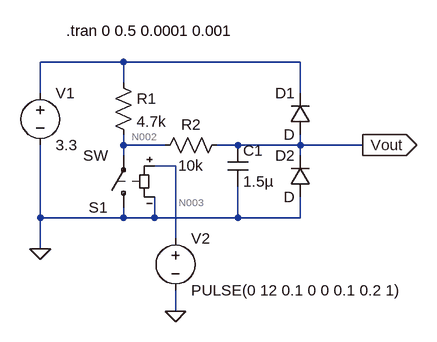
[diagram p0: schematic PB_RC_DEBOUNCE_SIM_R20200727A.asc]
PB_RC_DEBOUNCE_SIM_R20200727A.asc, the LTspice schematic file:
Version 4
SHEET 1 964 680
WIRE 128 48 0 48
WIRE 400 48 128 48
WIRE 128 80 128 48
WIRE 0 96 0 48
WIRE 400 96 400 48
WIRE 128 176 128 160
WIRE 192 176 128 176
WIRE 304 176 272 176
WIRE 400 176 400 160
WIRE 400 176 304 176
WIRE 496 176 400 176
WIRE 128 192 128 176
WIRE 400 192 400 176
WIRE 208 208 176 208
WIRE 0 288 0 176
WIRE 128 288 128 272
WIRE 128 288 0 288
WIRE 176 288 176 256
WIRE 176 288 128 288
WIRE 304 288 304 240
WIRE 304 288 176 288
WIRE 400 288 400 256
WIRE 400 288 304 288
WIRE 208 320 208 208
WIRE 0 336 0 288
WIRE 208 432 208 400
FLAG 0 336 0
FLAG 496 176 Vout
IOPIN 496 176 Out
FLAG 208 432 0
SYMBOL cap 288 176 R0
SYMATTR InstName C1
SYMATTR Value 1.5µ
SYMBOL diode 416 160 R180
WINDOW 0 24 64 Left 2
WINDOW 3 24 0 Left 2
SYMATTR InstName D1
SYMBOL diode 416 256 R180
WINDOW 0 24 64 Left 2
WINDOW 3 24 0 Left 2
SYMATTR InstName D2
SYMBOL voltage 0 80 R0
SYMATTR InstName V1
SYMATTR Value 3.3
SYMBOL res 112 64 R0
SYMATTR InstName R1
SYMATTR Value 4.7k
SYMBOL res 288 160 R90
WINDOW 0 0 56 VBottom 2
WINDOW 3 32 56 VTop 2
SYMATTR InstName R2
SYMATTR Value 10k
SYMBOL sw 128 288 R180
SYMATTR InstName S1
SYMBOL voltage 208 304 R0
WINDOW 123 0 0 Left 0
WINDOW 39 0 0 Left 0
SYMATTR InstName V2
SYMATTR Value PULSE(0 12 0.1 0 0 0.1 0.2 1)
TEXT 40 0 Left 2 !.tran 0 0.5 0.0001 0.001

The netlist it stands for:
* PB_RC_DEBOUNCE_SIM_R20200727A.asc
C1 Vout 0 1.5µ
D1 Vout N001 D
D2 0 Vout D
V1 N001 0 3.3
R1 N001 N002 4.7k
R2 Vout N002 10k
S1 0 N002 N003 0 SW
V2 N003 0 PULSE(0 12 0.1 0 0 0.1 0.2 1)
.model D D
.lib standard.dio
.tran 0 0.5 0.0001 0.001
.backanno
.end

* Results of the author's LTspice run, read from the files saved beside the schematic
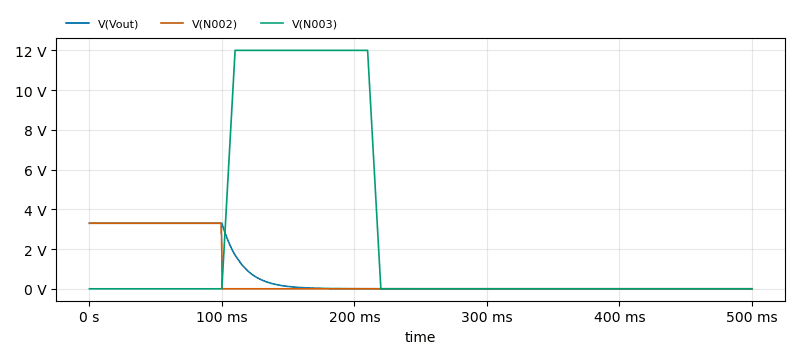
[diagram p1: Transient Analysis of PB_RC_DEBOUNCE_SIM_R20200727A.asc, plotted from the saved traces]
* Transient Analysis, 1 run:
*   V(Vout): min 699.9 µV, max 3.3 V, average 759.4 mV, rms 1.53 V, last 702 µV
*   V(N002): min 702 µV, max 3.3 V, average 659.5 mV, rms 1.474 V, last 702 µV
*   V(N003): min 0 V, max 12 V, average 2.641 V, rms 5.555 V, last 0 V